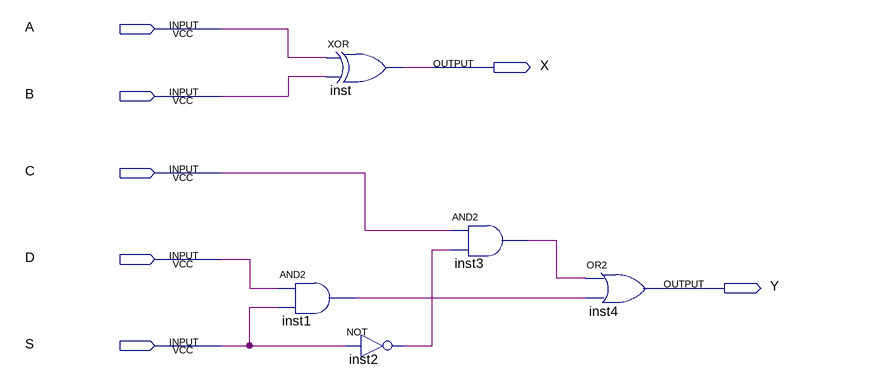
[diagram p0: schematic sheet]
// Quartus schematic Task2_XY.bdf as structural Verilog: 5 symbols, 7 pins
module Task2_XY (
  input  A,
  input  B,
  input  C,
  input  D,
  input  S,
  output X,
  output Y
);

  wire inst1_out, inst2_out, inst3_out;

  and inst1 (inst1_out, D, S);
  xor inst (X, A, B);
  not inst2 (inst2_out, S);
  and inst3 (inst3_out, C, inst2_out);
  or inst4 (Y, inst3_out, inst1_out);
endmodule
